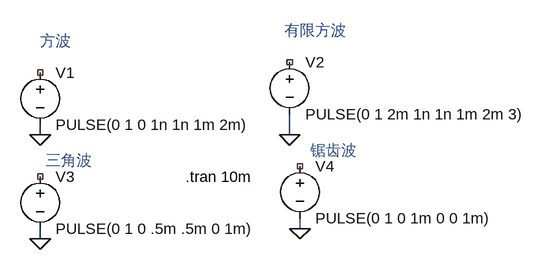
[diagram p0: schematic Draft1.asc]
Draft1.asc, the LTspice schematic file:
Version 4.1
SHEET 1 880 680
WIRE 80 128 80 112
WIRE 464 128 464 96
WIRE 480 272 480 256
WIRE 80 288 80 272
FLAG 80 128 0
FLAG 464 128 0
FLAG 80 288 0
FLAG 480 272 0
SYMBOL voltage 80 16 R0
WINDOW 123 0 0 Left 0
WINDOW 39 0 0 Left 0
SYMATTR InstName V1
SYMATTR Value PULSE(0 1 0 1n 1n 1m 2m)
SYMBOL voltage 464 0 R0
WINDOW 123 0 0 Left 0
WINDOW 39 0 0 Left 0
SYMATTR InstName V2
SYMATTR Value PULSE(0 1 2m 1n 1n 1m 2m 3)
SYMBOL voltage 80 176 R0
WINDOW 123 0 0 Left 0
WINDOW 39 0 0 Left 0
SYMATTR InstName V3
SYMATTR Value PULSE(0 1 0 .5m .5m 0 1m)
SYMBOL voltage 480 160 R0
WINDOW 123 0 0 Left 0
WINDOW 39 0 0 Left 0
SYMATTR InstName V4
SYMATTR Value PULSE(0 1 0 1m 0 0 1m)
TEXT 80 -16 Left 2 ;方波
TEXT 456 -32 Left 2 ;有限方波
TEXT 304 192 Left 2 !.tran 10m
TEXT 88 168 Left 2 ;三角波
TEXT 496 152 Left 2 ;锯齿波

The netlist it stands for:
* Draft1.asc
V1 NC_01 0 PULSE(0 1 0 1n 1n 1m 2m)
V2 NC_02 0 PULSE(0 1 2m 1n 1n 1m 2m 3)
V3 NC_03 0 PULSE(0 1 0 .5m .5m 0 1m)
V4 NC_04 0 PULSE(0 1 0 1m 0 0 1m)
* 方波
* 有限方波
.tran 10m
* 三角波
* 锯齿波
.backanno
.end